# Altium schematic sheet 仪表自测5.3.SchDoc
size A2
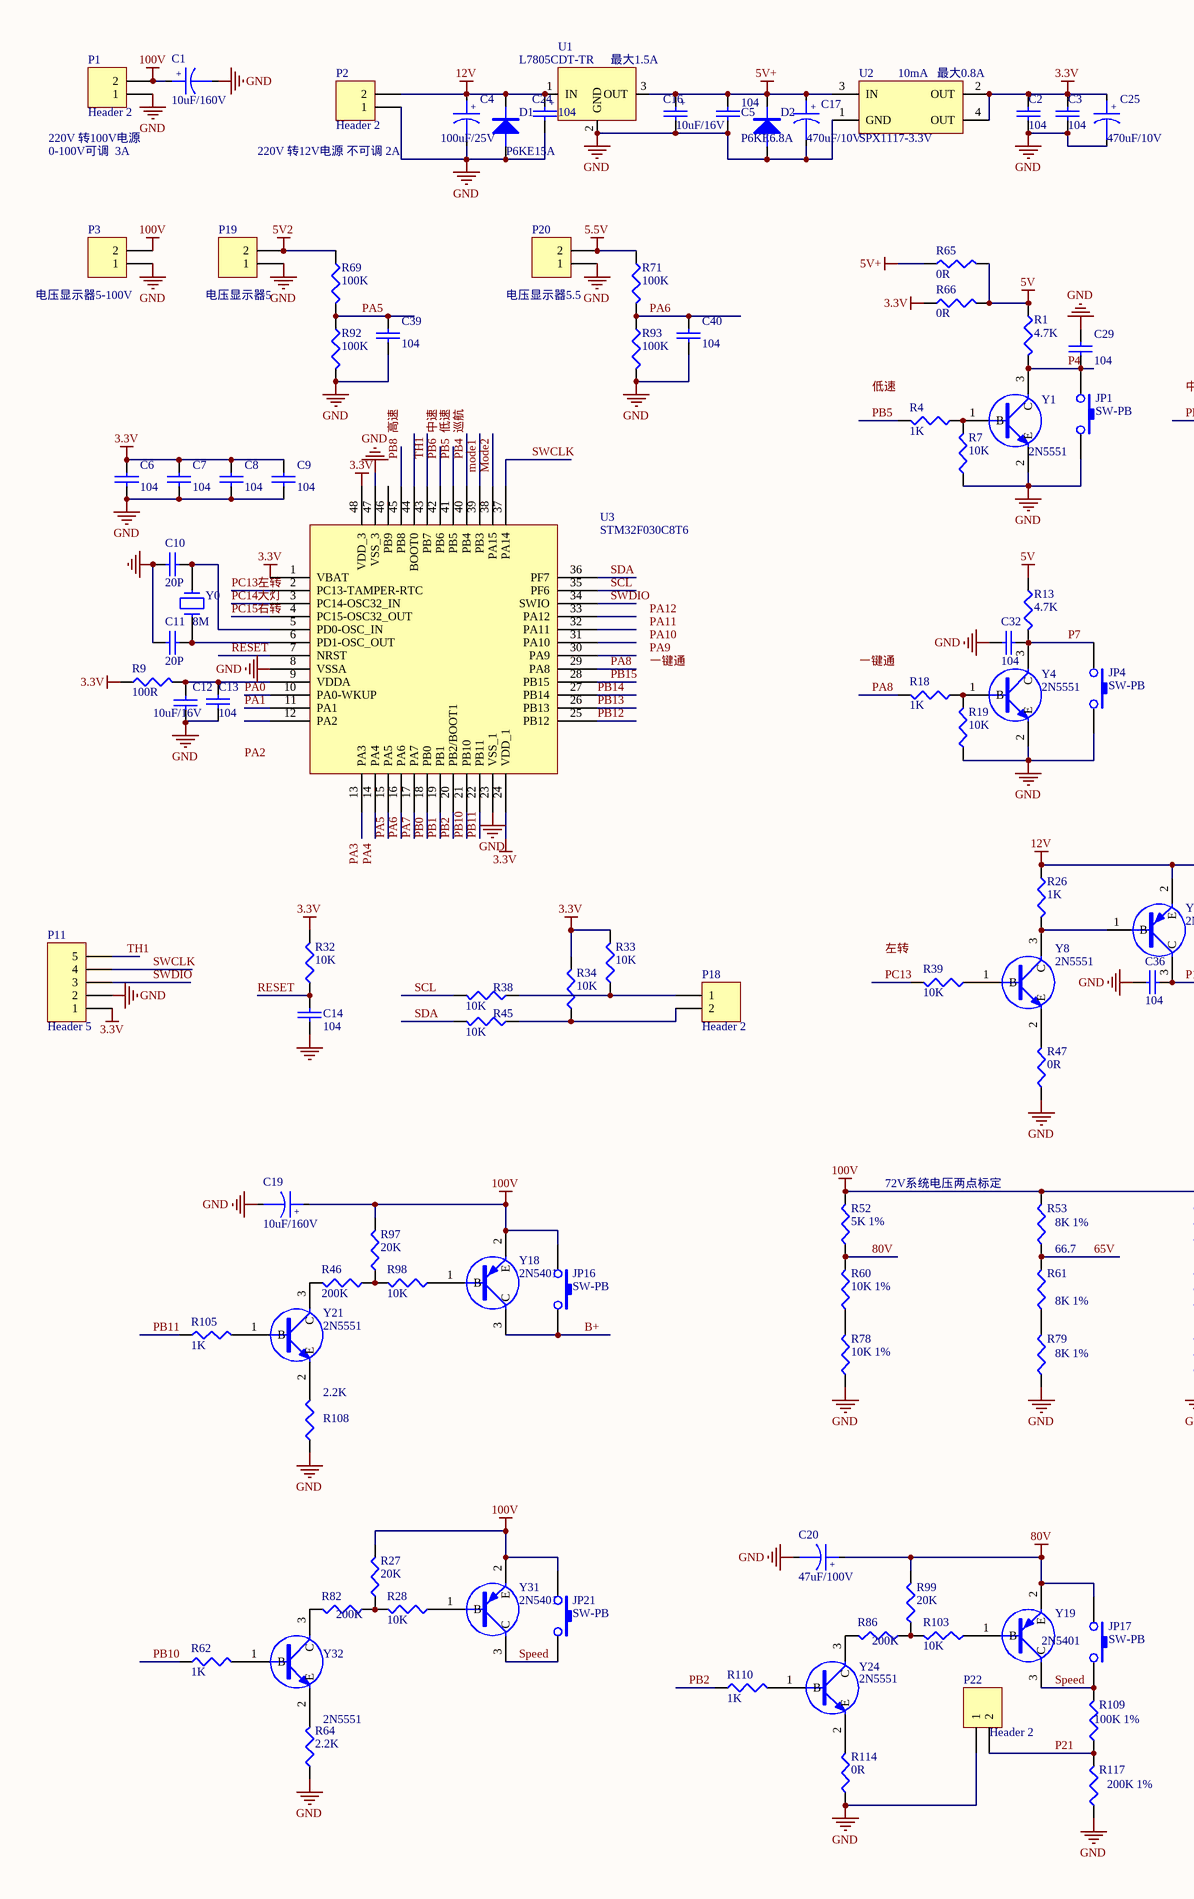
[diagram p0: 仪表自测5.3.SchDoc, left]
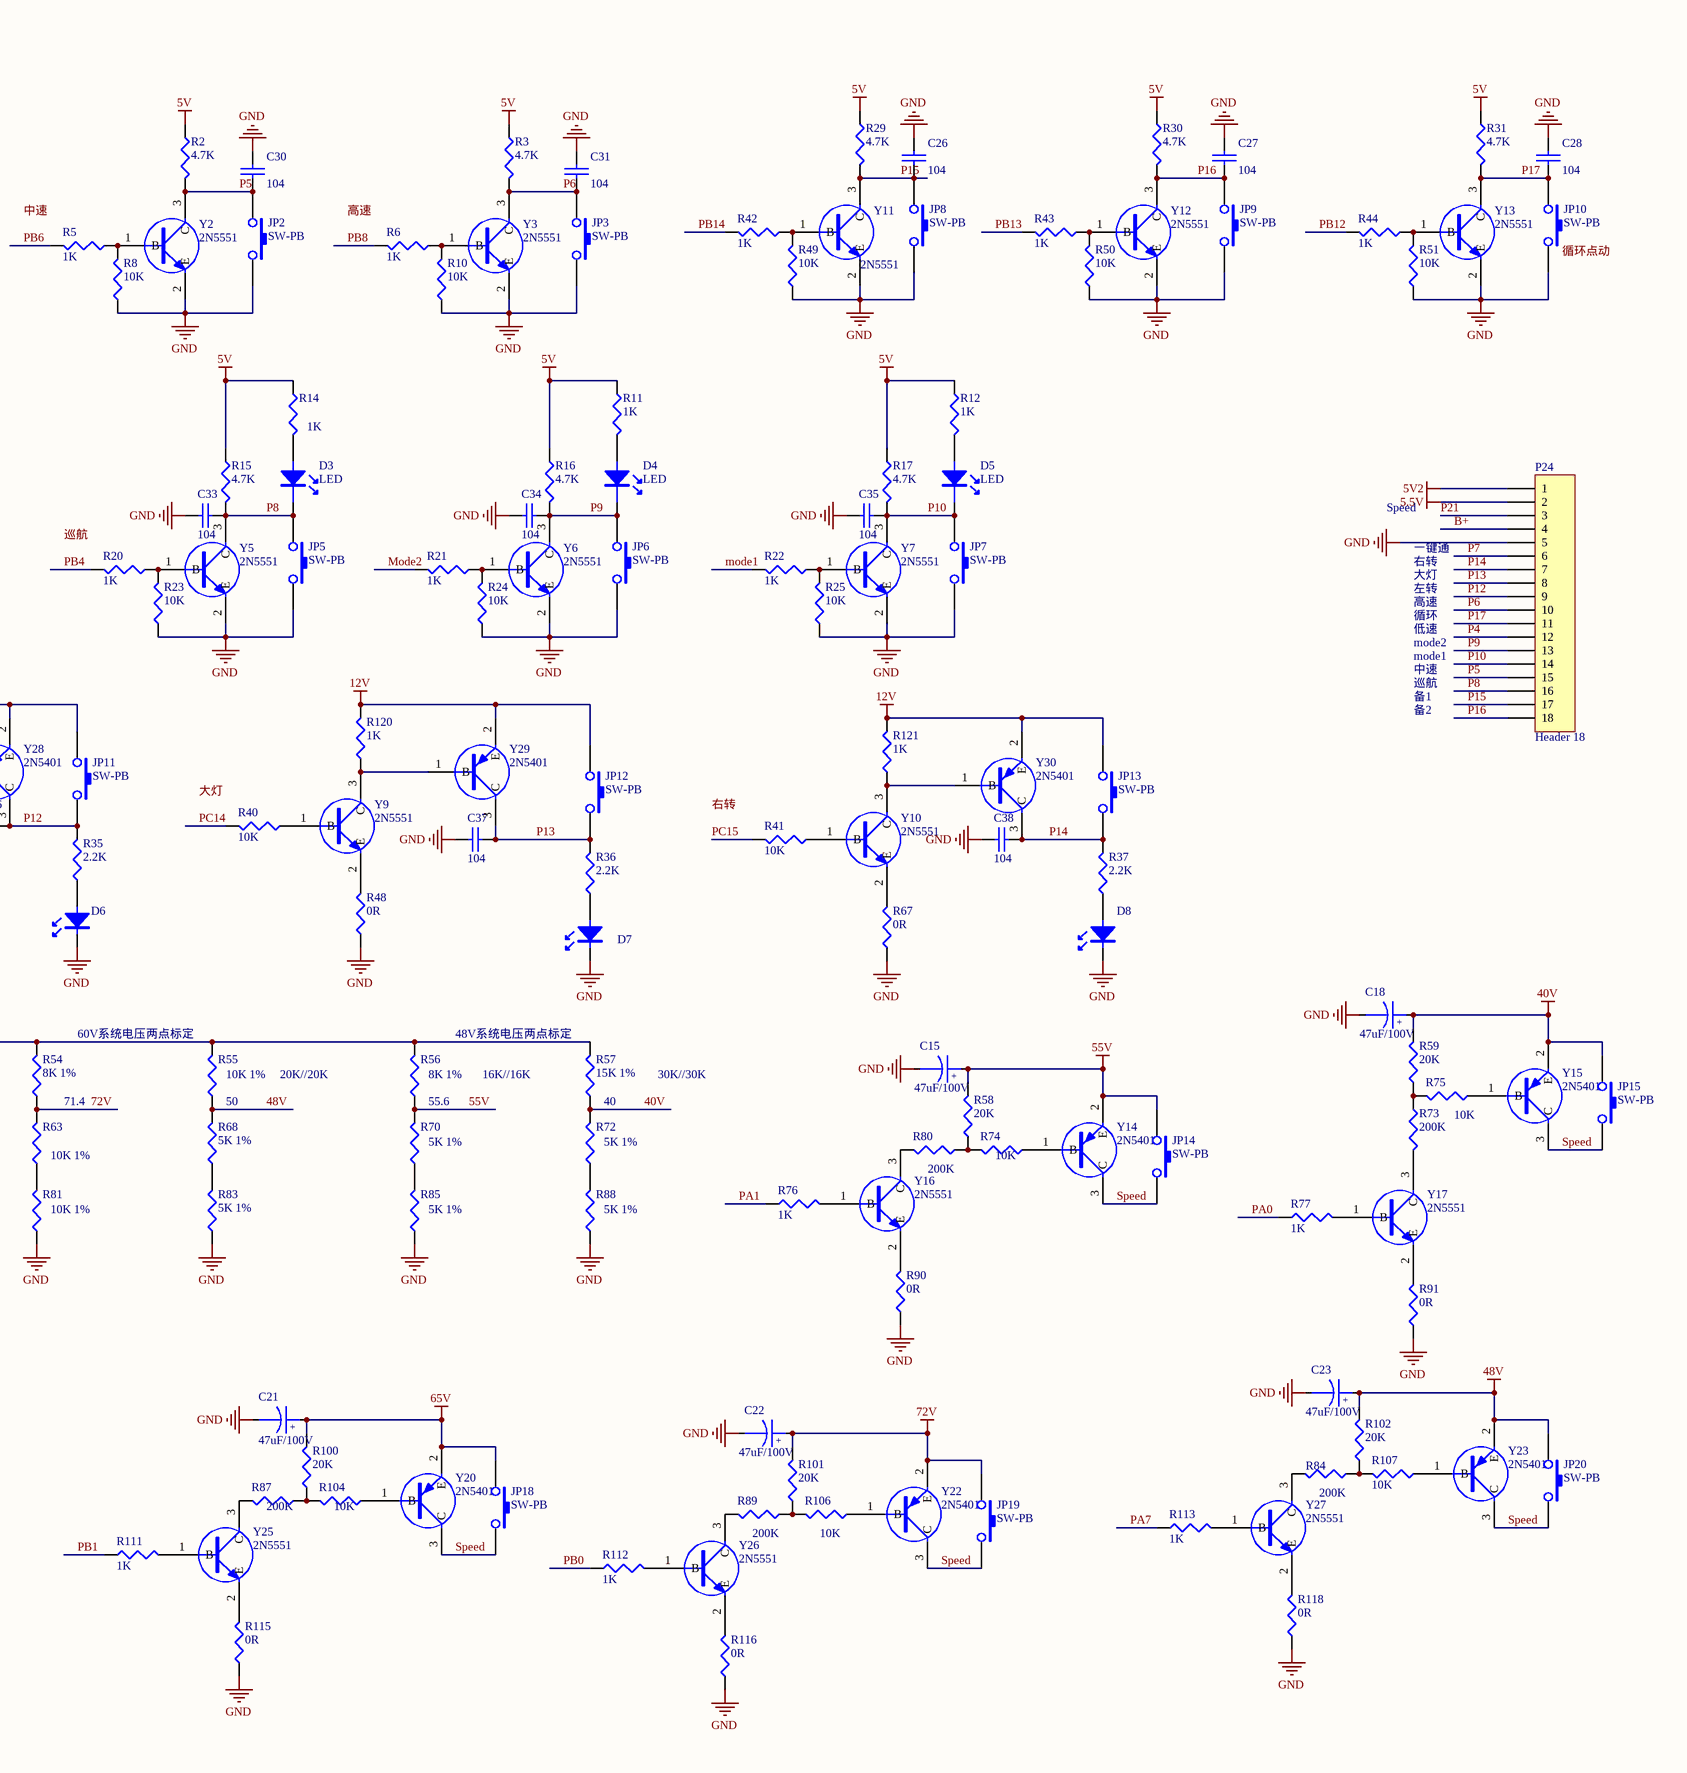
[diagram p1: 仪表自测5.3.SchDoc, right]

## Parts
C1  10uF/160V  [RB 8*12]
C2  104  [0805]
C3  104  [0805]
C4  100uF/25V  [RB.1/.2]
C5  104  [0805]
C6  104  [0805]
C7  104  [0805]
C8  104  [0805]
C9  104  [0805]
C10  20P  [0805]
C11  20P  [0805]
C12  10uF/16V  [1206]
C13  104  [0805]
C14  104  [0805]
C15  47uF/100V  [RB 8*12]
C16  10uF/16V  [1206]
C17  470uF/10V  [RB.1/.2]
C18  47uF/100V  [RB 8*12]
C19  10uF/160V  [RB 8*12]
C20  47uF/100V  [RB 8*12]
C21  47uF/100V  [RB 8*12]
C22  47uF/100V  [RB 8*12]
C23  47uF/100V  [RB 8*12]
C24  104  [0805]
C25  470uF/10V  [RB.1/.2]
C26  104  [0805]
C27  104  [0805]
C28  104  [0805]
C29  104  [0805]
C30  104  [0805]
C31  104  [0805]
C32  104  [0805]
C33  104  [0805]
C34  104  [0805]
C35  104  [0805]
C36  104  [0805]
C37  104  [0805]
C38  104  [0805]
C39  104  [0805]
C40  104  [0805]
D1  P6KE15A  [SMA]
D2  P6KE6.8A  [SMA]
D3  LED  [RB.1/.2]
D4  LED  [RB.1/.2]
D5  LED  [RB.1/.2]
D6  (no value)  [RB.1/.2]
D7  (no value)  [RB.1/.2]
D8  (no value)  [RB.1/.2]
JP1  SW-PB  [CON2]
JP2  SW-PB  [CON2]
JP3  SW-PB  [CON2]
JP4  SW-PB  [CON2]
JP5  SW-PB  [CON2]
JP6  SW-PB  [CON2]
JP7  SW-PB  [CON2]
JP8  SW-PB  [CON2]
JP9  SW-PB  [CON2]
JP10  SW-PB  [CON2]
JP11  SW-PB  [CON2]
JP12  SW-PB  [CON2]
JP13  SW-PB  [CON2]
JP14  SW-PB  [CON2]
JP15  SW-PB  [CON2]
JP16  SW-PB  [CON2]
JP17  SW-PB  [CON2]
JP18  SW-PB  [CON2]
JP19  SW-PB  [CON2]
JP20  SW-PB  [CON2]
JP21  SW-PB  [CON2]
P1  Header 2  [CON2]
P2  Header 2  [CON2]
P3  电压显示器5-100V  [CON2]
P11  Header 5  [HDR1X5]
P18  Header 2  [CON2]
P19  电压显示器5  [CON2]
P20  电压显示器5.5  [CON2]
P22  Header 2  [CON2]
P24  Header 18  [SIP18]
R1  4.7K  [0805]
R2  4.7K  [0805]
R3  4.7K  [0805]
R4  1K  [0805]
R5  1K  [0805]
R6  1K  [0805]
R7  10K  [0805]
R8  10K  [0805]
R9  100R  [0805]
R10  10K  [0805]
R11  1K  [0805]
R12  1K  [0805]
R13  4.7K  [0805]
R14  1K  [0805]
R15  4.7K  [0805]
R16  4.7K  [0805]
R17  4.7K  [0805]
R18  1K  [0805]
R19  10K  [0805]
R20  1K  [0805]
R21  1K  [0805]
R22  1K  [0805]
R23  10K  [0805]
R24  10K  [0805]
R25  10K  [0805]
R26  1K  [0805]
R27  20K  [0805]
R28  10K  [0805]
R29  4.7K  [0805]
R30  4.7K  [0805]
R31  4.7K  [0805]
R32  10K  [0805]
R33  10K  [0805]
R34  10K  [0805]
R35  2.2K  [0805]
R36  2.2K  [0805]
R37  2.2K  [0805]
R38  10K  [0805]
R39  10K  [0805]
R40  10K  [0805]
R41  10K  [0805]
R42  1K  [0805]
R43  1K  [0805]
R44  1K  [0805]
R45  10K  [0805]
R46  200K  [0805]
R47  0R  [0805]
R48  0R  [0805]
R49  10K  [0805]
R50  10K  [0805]
R51  10K  [0805]
R52  5K 1%  [1206]
R53  8K 1%  [1206]
R54  8K 1%  [1206]
R55  10K 1%  [1206]
R56  8K 1%  [1206]
R57  15K 1%  [1206]
R58  20K  [0805]
R59  20K  [0805]
R60  10K 1%  [1206]
R61  8K 1%  [1206]
R62  1K  [0805]
R63  10K 1%  [1206]
R64  2.2K  [0805]
R65  0R  [0805]
R66  0R  [0805]
R67  0R  [0805]
R68  5K 1%  [1206]
R69  100K  [0805]
R70  5K 1%  [1206]
R71  100K  [0805]
R72  5K 1%  [1206]
R73  200K  [0805]
R74  10K  [0805]
R75  10K  [0805]
R76  1K  [0805]
R77  1K  [0805]
R78  10K 1%  [1206]
R79  8K 1%  [1206]
R80  200K  [0805]
R81  10K 1%  [1206]
R82  200K  [0805]
R83  5K 1%  [1206]
R84  200K  [0805]
R85  5K 1%  [1206]
R86  200K  [0805]
R87  200K  [0805]
R88  5K 1%  [1206]
R89  200K  [0805]
R90  0R  [0805]
R91  0R  [0805]
R92  100K  [0805]
R93  100K  [0805]
R97  20K  [0805]
R98  10K  [0805]
R99  20K  [0805]
R100  20K  [0805]
R101  20K  [0805]
R102  20K  [0805]
R103  10K  [0805]
R104  10K  [0805]
R105  1K  [0805]
R106  10K  [0805]
R107  10K  [0805]
R108  2.2K  [0805]
R109  100K 1%  [2512]
R110  1K  [0805]
R111  1K  [0805]
R112  1K  [0805]
R113  1K  [0805]
R114  0R  [0805]
R115  0R  [0805]
R116  0R  [0805]
R117  200K 1%  [2512]
R118  0R  [0805]
R120  1K  [0805]
R121  1K  [0805]
U1  L7805CDT-TR  [TO-252]
U2  SPX1117-3.3V  [SOT-223]
U3  STM32F030C8T6  [STM32F103-LQFP48]
Y0  8M  [RAD0.2]
Y1  2N5551  [SOT-23]
Y2  2N5551  [SOT-23]
Y3  2N5551  [SOT-23]
Y4  2N5551  [SOT-23]
Y5  2N5551  [SOT-23]
Y6  2N5551  [SOT-23]
Y7  2N5551  [SOT-23]
Y8  2N5551  [SOT-23]
Y9  2N5551  [SOT-23]
Y10  2N5551  [SOT-23]
Y11  2N5551  [SOT-23]
Y12  2N5551  [SOT-23]
Y13  2N5551  [SOT-23]
Y14  2N5401  [SOT-23]
Y15  2N5401  [SOT-23]
Y16  2N5551  [SOT-23]
Y17  2N5551  [SOT-23]
Y18  2N5401  [SOT-23]
Y19  2N5401  [SOT-23]
Y20  2N5401  [SOT-23]
Y21  2N5551  [SOT-23]
Y22  2N5401  [SOT-23]
Y23  2N5401  [SOT-23]
Y24  2N5551  [SOT-23]
Y25  2N5551  [SOT-23]
Y26  2N5551  [SOT-23]
Y27  2N5551  [SOT-23]
Y28  2N5401  [SOT-23]
Y29  2N5401  [SOT-23]
Y30  2N5401  [SOT-23]
Y31  2N5401  [SOT-23]
Y32  2N5551  [SOT-23]

## Nets
3.3V: C2.1 C3.1 C6.2 C7.2 C8.2 C9.2 C25.1 P11.1 R9.1 R32.2 R33.2 R34.2 R66.1 U2.2(OUT) U2.4(OUT) U3.1(VBAT) U3.24(VDD_1) U3.48(VDD_3)
5.5V: P20.2 P24.2 R71.1
5V: R1.1 R2.1 R3.1 R11.1 R12.1 R13.1 R14.1 R15.1 R16.1 R17.1 R29.1 R30.1 R31.1 R65.2 R66.2
5V2: P19.2 P24.1 R69.1
5V+: C5.1 C16.1 C17.1 D2.2(K) R65.1 U1.3(OUT) U2.3(IN)
12V: C4.1 C24.1 D1.2(K) JP11.1 JP12.1 JP13.1 P2.2 R26.1 R120.2 R121.2 U1.1(IN) Y28.2(E) Y29.2(E) Y30.2(E)
40V: C18.1 JP15.1 R57.1 R59.2 R72.2 Y15.2(E)
48V: C23.1 JP20.1 R55.1 R68.2 R102.2 Y23.2(E)
55V: C15.1 JP14.1 R56.1 R58.2 R70.2 Y14.2(E)
65V: C21.1 JP18.1 R53.1 R61.2 R100.2 Y20.2(E)
72V: C22.1 JP19.1 R54.1 R63.2 R101.2 Y22.2(E)
80V: C20.1 JP17.1 R52.1 R60.2 R99.2 Y19.2(E)
100V: C1.1 C19.1 JP16.1 JP21.1 P1.2 P3.2 R27.2 R52.2 R53.2 R54.2 R55.2 R56.2 R57.2 R97.2 Y18.2(E) Y31.2(E)
GND: C1.2 C2.2 C3.2 C4.2 C5.2 C6.1 C7.1 C8.1 C9.1 C10.1 C11.1 C12.1 C13.1 C14.2 C15.2 C16.2 C17.2 C18.2 C19.2 C20.2 C21.2 C22.2 C23.2 C24.2 C25.2 C26.1 C27.1 C28.1 C29.1 C30.1 C31.1 C32.1 C33.1 C34.1 C35.1 C36.1 C37.1 C38.1 C39.1 C40.1 D1.1(A) D2.1(A) D6.2(K) D7.2(K) D8.2(K) JP1.2 JP2.2 JP3.2 JP4.2 JP5.2 JP6.2 JP7.2 JP8.2 JP9.2 JP10.2 P1.1 P2.1 P3.1 P11.2 P19.1 P20.1 P22.1 P24.5 R7.1 R8.1 R10.1 R19.1 R23.1 R24.1 R25.1 R47.1 R48.1 R49.1 R50.1 R51.1 R64.1 R67.1 R78.1 R79.1 R81.1 R83.1 R85.1 R88.1 R90.1 R91.1 R92.2 R93.2 R108.1 R114.1 R115.1 R116.1 R117.1 R118.1 U1.2(GND) U2.1(GND) U3.8(VSSA) U3.23(VSS_1) U3.47(VSS_3) Y1.2(E) Y2.2(E) Y3.2(E) Y4.2(E) Y5.2(E) Y6.2(E) Y7.2(E) Y11.2(E) Y12.2(E) Y13.2(E)
B+: JP16.2 P24.4 Y18.3(C)
mode1: R22.2 U3.39(PB3)
Mode2: R21.2 U3.38(PA15)
P4: C29.2 JP1.1 P24.12 R1.2 Y1.3(C)
P5: C30.2 JP2.1 P24.15 R2.2 Y2.3(C)
P6: C31.2 JP3.1 P24.10 R3.2 Y3.3(C)
P7: C32.2 JP4.1 P24.6 R13.2 Y4.3(C)
P8: C33.2 D3.2 JP5.1 P24.16 R15.2 Y5.3(C)
P9: C34.2 D4.2 JP6.1 P24.13 R16.2 Y6.3(C)
P10: C35.2 D5.2 JP7.1 P24.14 R17.2 Y7.3(C)
P12: C36.2 JP11.2 P24.9 R35.2 Y28.3(C)
P13: C37.2 JP12.2 P24.8 R36.2 Y29.3(C)
P14: C38.2 JP13.2 P24.7 R37.2 Y30.3(C)
P15: C26.2 JP8.1 P24.17 R29.2 Y11.3(C)
P16: C27.2 JP9.1 P24.18 R30.2 Y12.3(C)
P17: C28.2 JP10.1 P24.11 R31.2 Y13.3(C)
P21: P22.2 P24.3 R109.1 R117.2
PA0: R77.1 U3.10(PA0-WKUP)
PA1: R76.1 U3.11(PA1)
PA5: C39.2 R69.2 R92.1 U3.15(PA5)
PA6: C40.2 R71.2 R93.1 U3.16(PA6)
PA7: R113.1 U3.17(PA7)
PA8: R18.2 U3.29(PA8)
PB0: R112.1 U3.18(PB0)
PB1: R111.1 U3.19(PB1)
PB2: R110.1 U3.20(PB2/BOOT1)
PB4: R20.2 U3.40(PB4)  [also labelled 巡航]
PB5: R4.2 U3.41(PB5)
PB6: R5.2 U3.42(PB6)
PB8: R6.2 U3.45(PB8)
PB10: R62.1 U3.21(PB10)
PB11: R105.1 U3.22(PB11)
PB12: R44.2 U3.25(PB12)
PB13: R43.2 U3.26(PB13)
PB14: R42.2 U3.27(PB14)
PB15: U3.28(PB15)
PC13: R39.2 U3.2(PC13-TAMPER-RTC)  [also labelled 左转]
PC14: R40.2 U3.3(PC14-OSC32_IN)  [also labelled 大灯]
PC15: R41.2 U3.4(PC15-OSC32_OUT)  [also labelled 右转]
RESET: C14.1 R32.1 U3.7(NRST)
SCL: R38.2 U3.35(PF6)
SDA: R45.2 U3.36(PF7)
Speed: JP14.2 JP15.2 JP17.2 JP18.2 JP19.2 JP20.2 JP21.2 R109.2 Y14.3(C) Y15.3(C) Y19.3(C) Y20.3(C) Y22.3(C) Y23.3(C) Y31.3(C)
SWCLK: P11.4 U3.37(PA14)
SWDIO: P11.3 U3.34(SWIO)
TH1: P11.5 U3.43(PB7)
NetC10_2: C10.2 U3.5(PD0-OSC_IN) Y0.2
NetC11_2: C11.2 U3.6(PD1-OSC_OUT) Y0.1
NetC12_2: C12.2 C13.2 R9.2 U3.9(VDDA)
NetD3_1: D3.1 R14.2
NetD4_1: D4.1 R11.2
NetD5_1: D5.1 R12.2
NetD6_1: D6.1(A) R35.1
NetD7_1: D7.1(A) R36.1
NetD8_1: D8.1(A) R37.1
NetP18_1: P18.1 R33.1 R38.1
NetP18_2: P18.2 R34.1 R45.1
NetR4_1: R4.1 R7.2 Y1.1(B)
NetR5_1: R5.1 R8.2 Y2.1(B)
NetR6_1: R6.1 R10.2 Y3.1(B)
NetR18_1: R18.1 R19.2 Y4.1(B)
NetR20_1: R20.1 R23.2 Y5.1(B)
NetR21_1: R21.1 R24.2 Y6.1(B)
NetR22_1: R22.1 R25.2 Y7.1(B)
NetR26_2: R26.2 Y8.3(C) Y28.1(B)
NetR27_1: R27.1 R28.2 R82.1
NetR28_1: R28.1 Y31.1(B)
NetR39_1: R39.1 Y8.1(B)
NetR40_1: R40.1 Y9.1(B)
NetR41_1: R41.1 Y10.1(B)
NetR42_1: R42.1 R49.2 Y11.1(B)
NetR43_1: R43.1 R50.2 Y12.1(B)
NetR44_1: R44.1 R51.2 Y13.1(B)
NetR46_1: R46.1 R97.1 R98.2
NetR46_2: R46.2 Y21.3(C)
NetR47_2: R47.2 Y8.2(E)
NetR48_2: R48.2 Y9.2(E)
NetR58_1: R58.1 R74.2 R80.1
NetR59_1: R59.1 R73.1 R75.2
NetR60_1: R60.1 R78.2
NetR61_1: R61.1 R79.2
NetR62_2: R62.2 Y32.1(B)
NetR63_1: R63.1 R81.2
NetR64_2: R64.2 Y32.2(E)
NetR67_2: R67.2 Y10.2(E)
NetR68_1: R68.1 R83.2
NetR70_1: R70.1 R85.2
NetR72_1: R72.1 R88.2
NetR73_2: R73.2 Y17.3(C)
NetR74_1: R74.1 Y14.1(B)
NetR75_1: R75.1 Y15.1(B)
NetR76_2: R76.2 Y16.1(B)
NetR77_2: R77.2 Y17.1(B)
NetR80_2: R80.2 Y16.3(C)
NetR82_2: R82.2 Y32.3(C)
NetR84_1: R84.1 R102.1 R107.2
NetR84_2: R84.2 Y27.3(C)
NetR86_1: R86.1 R99.1 R103.2
NetR86_2: R86.2 Y24.3(C)
NetR87_1: R87.1 R100.1 R104.2
NetR87_2: R87.2 Y25.3(C)
NetR89_1: R89.1 R101.1 R106.2
NetR89_2: R89.2 Y26.3(C)
NetR90_2: R90.2 Y16.2(E)
NetR91_2: R91.2 Y17.2(E)
NetR98_1: R98.1 Y18.1(B)
NetR103_1: R103.1 Y19.1(B)
NetR104_1: R104.1 Y20.1(B)
NetR105_2: R105.2 Y21.1(B)
NetR106_1: R106.1 Y22.1(B)
NetR107_1: R107.1 Y23.1(B)
NetR108_2: R108.2 Y21.2(E)
NetR110_2: R110.2 Y24.1(B)
NetR111_2: R111.2 Y25.1(B)
NetR112_2: R112.2 Y26.1(B)
NetR113_2: R113.2 Y27.1(B)
NetR114_2: R114.2 Y24.2(E)
NetR115_2: R115.2 Y25.2(E)
NetR116_2: R116.2 Y26.2(E)
NetR118_2: R118.2 Y27.2(E)
NetR120_1: R120.1 Y9.3(C) Y29.1(B)
NetR121_1: R121.1 Y10.3(C) Y30.1(B)

Not connected (* = marked no-connect by the designer): U3 12(PA2) 13(PA3) 14(PA4) 30(PA9) 31(PA10) 32(PA11) 33(PA12) 44(BOOT0) 46(PB9)

## Notes on the sheet
- (near U1) 最大1.5A
- (near U2) 10mA
- (near U2) 最大0.8A
- (near P1) 220V 转100V电源
- 0-100V可调  3A
- (near P2) 220V 转12V电源 不可调 2A
- Speed
- 大灯
- 左转
- 右转
- 一键通
- mode1
- 低速
- mode2
- 循环
- 高速
- 备2
- 备1
- 巡航
- 中速
- (near R52) 72V系统电压两点标定
- (near R54) 60V系统电压两点标定
- (near R56) 48V系统电压两点标定
- 66.7
- 71.4
- 50
- 20K//20K
- 55.6
- 16K//16K
- 40
- 30K//30K
- Labels drawn without touching a wire or pin: PA2, PA3, PA4, PA9, PA10, PA11, PA12, 一键通, 中速, 低速, 右转, 大灯, 巡航, 左转, 循环点动, 高速
- (in symbol CAP_1) +
- (in symbol Capacitor) +

## Library data of the parts
C1 C4 C15 C17-C23 C25 = Capacitor
C2 C3 C5 C14 C26-C38 = Cap
C6-C13 C39 C40 = CAP: Capacitor
C16 C24 = CAP_1: Capacitor
D1 D2 = DIODE
D6-D8 = LED
P1-P3 P18-P20 P22 = Header 2: Header, 2-Pin; LatestRevisionDate: 17-Jul-2002; LatestRevisionNote: Re-released for DXP Platform.; Publisher: Altium Limited
P11 = Header 5: Header, 5-Pin; LatestRevisionDate: 17-Jul-2002; LatestRevisionNote: Re-released for DXP Platform.; Publisher: Altium Limited
P24 = Header 18: Header, 18-Pin; LatestRevisionDate: 17-Jul-2002; LatestRevisionNote: Re-released for DXP Platform.; Publisher: Altium Limited
R1-R93 R97-R118 R120 R121 = RES1
U1 = IC3: brand: ST
Y0 = CRYSTAL
Y1-Y13 Y16 Y17 Y21 Y24-Y27 Y32 = NPN SOT-23
Y14 Y15 Y18-Y20 Y22 Y23 Y28-Y31 = PNP SOT-23